# EAGLE design Fan__control_design (EAGLE 7.7.0)
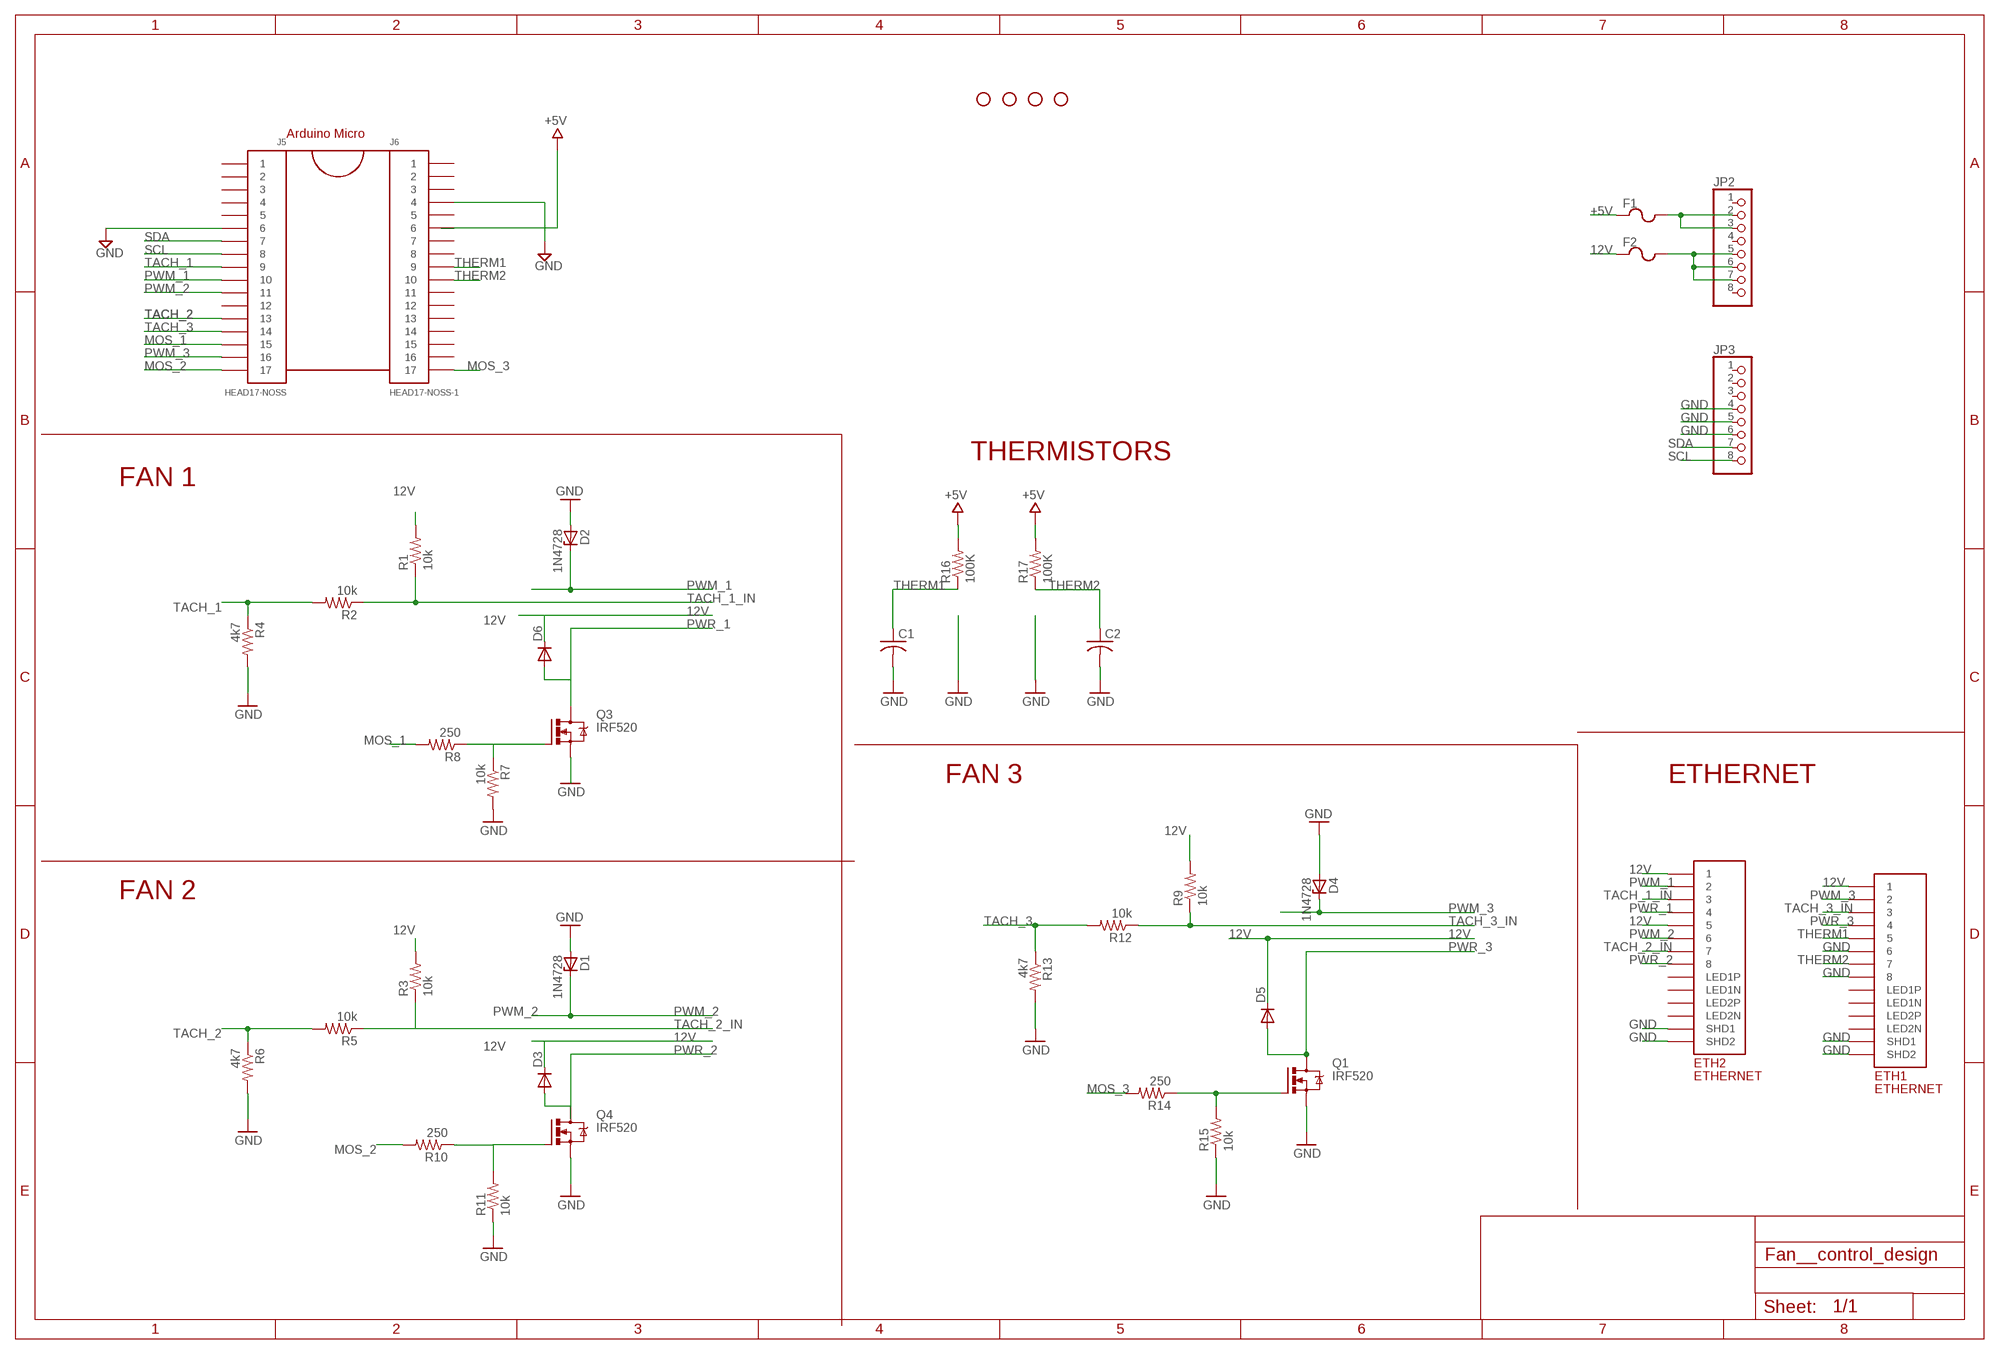
[diagram p0: schematic, sheet 1]

## Parts
C1  C-USC0603K  [C0603K]
C2  C-USC0603K  [C0603K]
D1  1N4728  [DO41Z10]
D2  1N4728  [DO41Z10]
D3  DIODE-DO214AC  [DO214AC]
D4  1N4728  [DO41Z10]
D5  DIODE-DO214AC  [DO214AC]
D6  DIODE-DO214AC  [DO214AC]
ETH1  ETHERNET  [A122645-ND]
ETH2  ETHERNET  [A122645-ND]
F1  POLYFUSE  [1206]
F2  POLYFUSE  [1206]
J5  HEAD17-NOSS  [HEAD17-NOSS]
J6  HEAD17-NOSS-1  [HEAD17-NOSS-1]
JP2  PINHD-1X8BIG  [1X08-BIG]
JP3  PINHD-1X8BIG  [1X08-BIG]
Q1  IRF520  [TO220BV]
Q3  IRF520  [TO220BV]
Q4  IRF520  [TO220BV]
R1  10k  R-US_R0603  [R0603]
R2  10k  R-US_R0603  [R0603]
R3  10k  R-US_R0603  [R0603]
R4  4k7  R-US_R0603  [R0603]
R5  10k  R-US_R0603  [R0603]
R6  4k7  R-US_R0603  [R0603]
R7  10k  R-US_R0603  [R0603]
R8  250  R-US_R0603  [R0603]
R9  10k  R-US_R0603  [R0603]
R10  250  R-US_R0603  [R0603]
R11  10k  R-US_R0603  [R0603]
R12  10k  R-US_R0603  [R0603]
R13  4k7  R-US_R0603  [R0603]
R14  250  R-US_R0603  [R0603]
R15  10k  R-US_R0603  [R0603]
R16  100K  R-US_R0603  [R0603]
R17  100K  R-US_R0603  [R0603]
STANDOFF1  STAND-OFF  [STAND-OFF]
STANDOFF2  STAND-OFF  [STAND-OFF]
STANDOFF3  STAND-OFF  [STAND-OFF]
STANDOFF4  STAND-OFF  [STAND-OFF]

## Nets
12V: D3.C D5.C D6.C ETH1.P$1 ETH2.P$1 ETH2.P$5 F2.1 R1.2 R3.2 R9.2
+5V: F1.1 J6.6 R16.2 R17.2
GND: C1.2 C2.2 D1.A D2.A D4.A ETH1.P$6 ETH1.P$8 ETH1.P$13(SHD1) ETH1.P$14(SHD2) ETH2.P$13(SHD1) ETH2.P$14(SHD2) J5.6 J6.4 JP3.4 JP3.5 JP3.6 Q1.S Q3.S Q4.S R4.2 R6.2 R7.2 R11.1 R13.2 R15.1
MOS_1: J5.15 R8.2
MOS_2: J5.17 R10.2
MOS_3: J6.17 R14.2
N$1: F1.2 JP2.2 JP2.3
N$2: F2.2 JP2.5 JP2.6 JP2.7
N$5: Q3.G R7.1 R8.1
N$8: Q4.G R10.1 R11.2
N$10: Q1.G R14.1 R15.2
PWM_1: D2.C ETH2.P$2 J5.10
PWM_2: D1.C ETH2.P$6 J5.11
PWM_3: D4.C ETH1.P$2 J5.16
PWR_1: D6.A ETH2.P$4 Q3.D
PWR_2: D3.A ETH2.P$8 Q4.D
PWR_3: D5.A ETH1.P$4 Q1.D
SCL: J5.8 JP3.8
SDA: J5.7 JP3.7
TACH_1: J5.9 R2.2 R4.1
TACH_1_IN: ETH2.P$3 R1.1 R2.1
TACH_2: J5.13 R5.2 R6.1
TACH_2_IN: ETH2.P$7 R3.1 R5.1
TACH_3: J5.14 R12.2 R13.1
TACH_3_IN: ETH1.P$3 R9.1 R12.1
THERM1: C1.1 ETH1.P$5 J6.9 R16.1
THERM2: C2.1 ETH1.P$7 J6.10 R17.1
Unconnected: ETH1.P$9(LED1N) ETH1.P$10(LED1P) ETH1.P$11(LED2N) ETH1.P$12(LED2P) ETH2.P$9(LED1N) ETH2.P$10(LED1P) ETH2.P$11(LED2N) ETH2.P$12(LED2P) J5.1 J5.2 J5.3 J5.4 J5.5 J5.12 J6.1 J6.2 J6.3 J6.5 J6.7 J6.8 J6.11 J6.12 J6.13 J6.14 J6.15 J6.16 JP2.1 JP2.4 JP2.8 JP3.1 JP3.2 JP3.3

## Notes on the sheet
- Arduino Micro
- THERMISTORS
- FAN 1
- FAN 3 | ETHERNET
- FAN 2

## Library data of the parts
C1 C2 = adafruit:C-US: CAPACITOR, American symbol
D1 D2 D4 = diode:1N4728: Z DIODE 3.3 V, 1W, 5 percent
D3 D5 D6 = diode:DIODE-: DIODE
ETH1 ETH2 = ETHERNET:ETHERNET: Ethernet port with 2 leds. digikey number A122645-ND
F1 F2 = polyfuse:POLYFUSE: Resistor Basic schematic elements and footprints for 0603, 1206, and PTH resistors.
J5 = SmartPrj:HEAD17-NOSS
J6 = SmartPrj:HEAD17-NOSS-1
JP2 JP3 = adafruit:PINHD-1X8: PIN HEADER
Q1 Q3 Q4 = transistor-power:IRF520: HEXFET Power MOSFET
R1-R17 = adafruit:R-US_: RESISTOR, American symbol
STANDOFF1-STANDOFF4 = SparkFun-Electromechanical:STAND-OFF: #4 Stand Off This is the mechanical footprint for a #4 phillips button head screw. Use the keepout ring to avoid running the screw head into surrounding components. SKU : PRT-00447

## Net classes
0 default: width 0.254 mm, drill 0.61 mm, clearance 0.203 mm

## Board
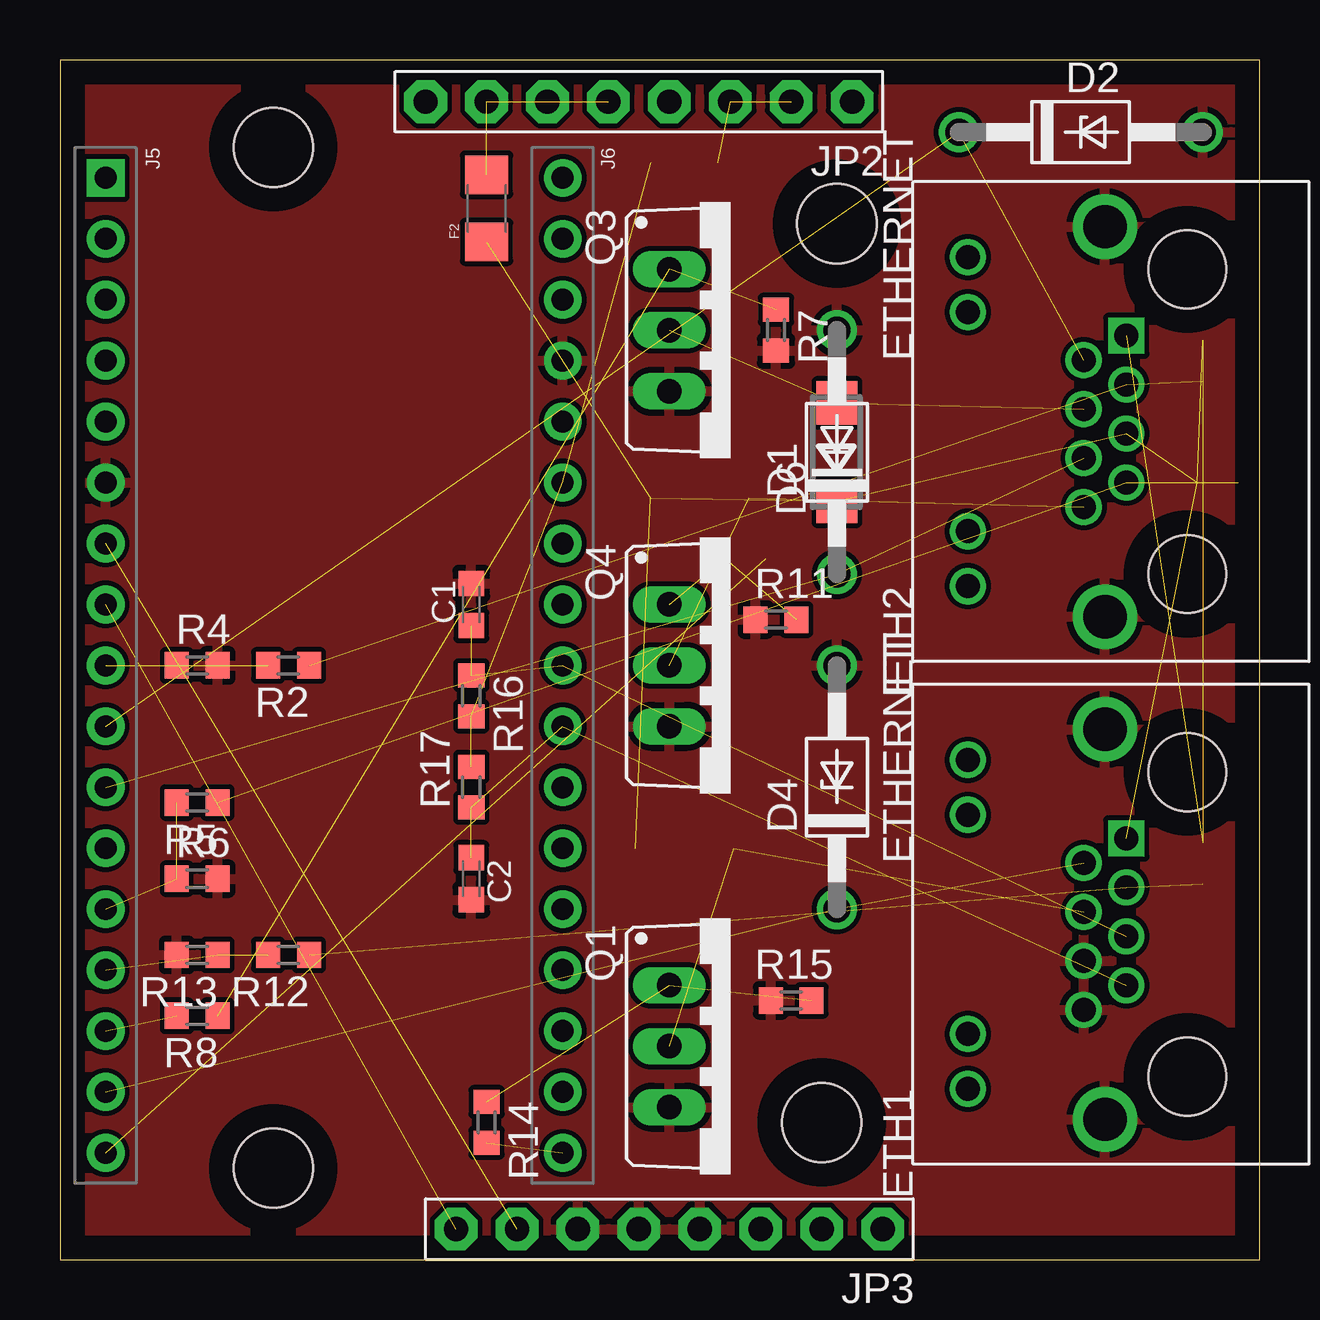
[diagram p1: board, top side]
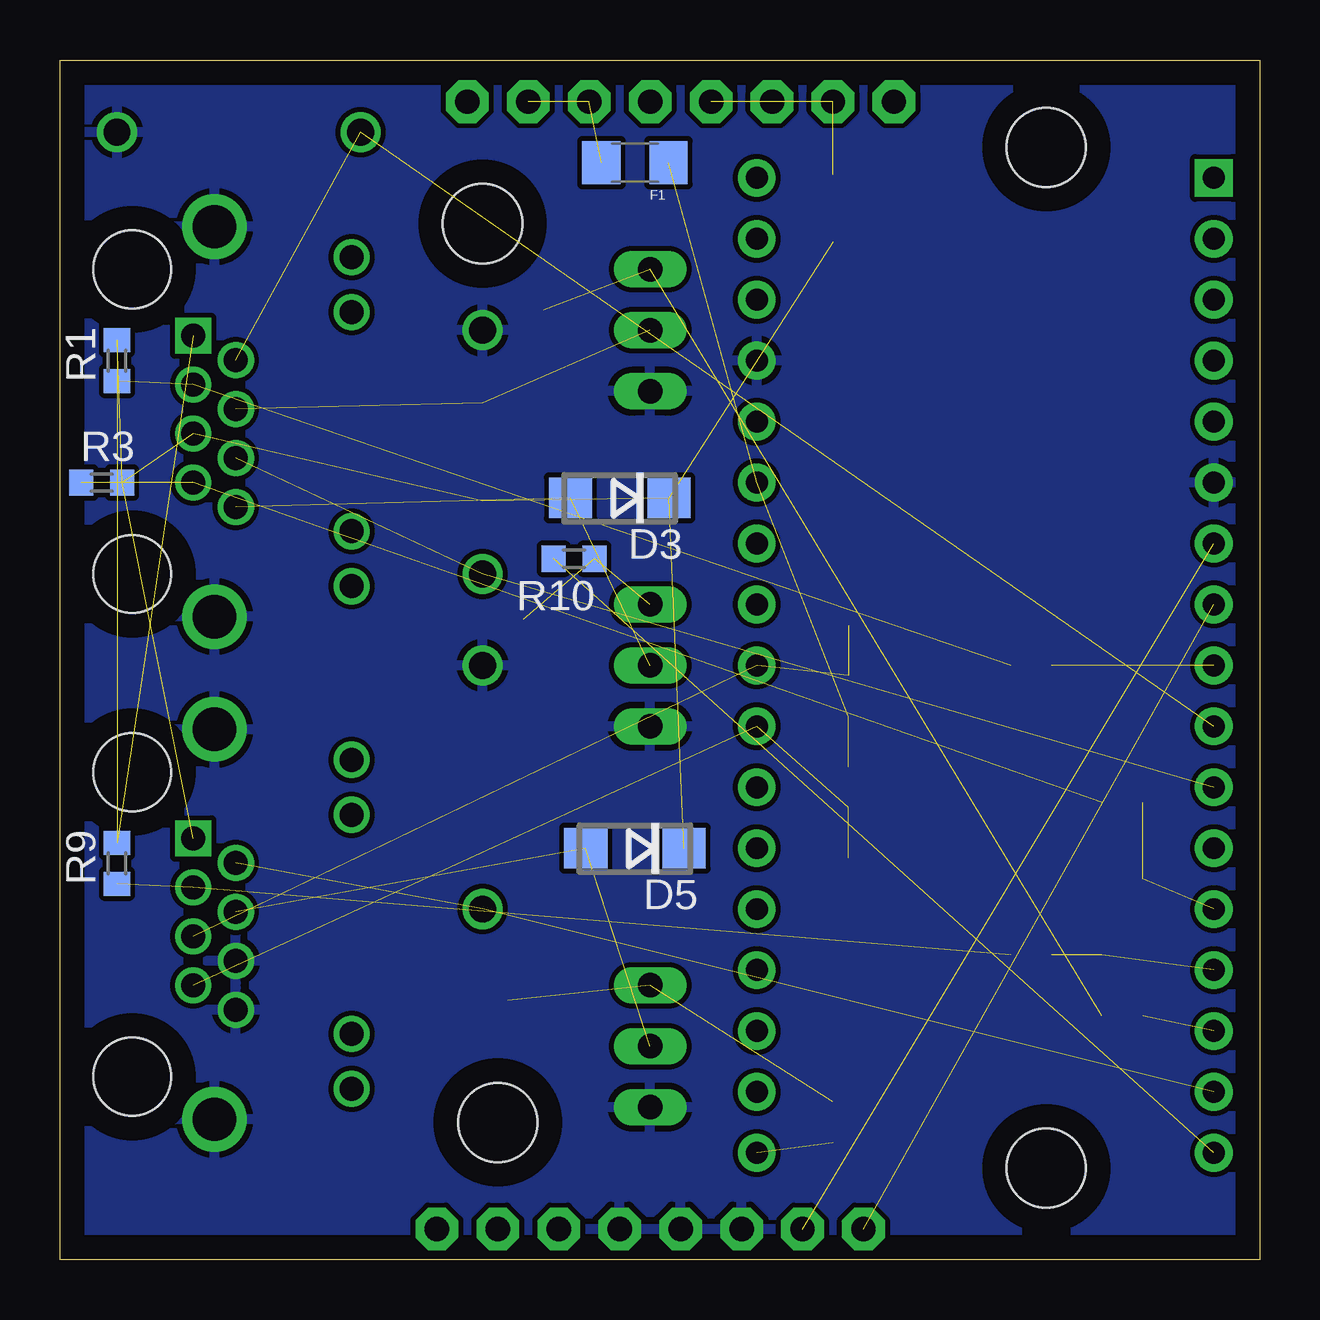
[diagram p2: board, bottom side, seen from below]

Size 50 x 50 mm. Coordinates in mm from the lower left corner, seen from the top.
Outline: 0,0 50,0 50,50 0,50 0,0
Copper layers (1*16): Top 0.035mm / dielectric 1.5mm / Bottom 0.035mm
Design rules "default": minimum track width 10mil, minimum drill 24mil, track to track 8mil, track to pad 8mil, pad to pad 8mil, via to via 8mil, smd to smd 8mil, copper to edge 40mil, drill to drill 8mil, minimum pad ring 10mil, minimum via ring 8mil, stop-mask expansion 4mil, vias tented up to drill 0mil, thermal gap 10mil

### Footprints (pad centres in the part's own frame; a part is rotated, then mirrored left to right if it is on the bottom)
C0603K = smd 1.05 x 1.08: 1 -0.875,0; 2 0.875,0
DO41Z10 = drill 1.118: A 5.08,0; C -5.08,0
DO214AC = smd 1.8 x 1.7: A 2.05,0; C -2.05,0
A122645-ND = drill 1 square: P$1 3.58,2.54 | drill 1: P$2 2.56,4.32; P$3 1.54,2.54; P$4 0.52,4.32; P$5 -0.5,2.54; P$6 -1.52,4.32; P$7 -2.54,2.54; P$8 -3.56,4.32; P$9 -6.86,9.14; P$10 -4.57,9.14; P$11 4.57,9.14; P$12 6.86,9.14 | drill 1.8: P$13 -8.13,3.43; P$14 8.13,3.43 | hole 3.25: -6.35,0; 6.35,0
1206 = smd 1.6 x 1.8: 1 -1.4,0; 2 1.4,0
HEAD17-NOSS = drill 0.914 pad 1.575 square: 1 0,0 | drill 0.914 pad 1.575: 2 2.54,0; 3 5.08,0; 4 7.62,0; 5 10.16,0; 6 12.7,0; 7 15.24,0; 8 17.78,0; 9 20.32,0; 10 22.86,0; 11 25.4,0; 12 27.94,0; 13 30.48,0; 14 33.02,0; 15 35.56,0; 16 38.1,0; 17 40.64,0
HEAD17-NOSS-1 = drill 0.914 pad 1.575: 1 0,0; 2 2.54,0; 3 5.08,0; 4 7.62,0; 5 10.16,0; 6 12.7,0; 7 15.24,0; 8 17.78,0; 9 20.32,0; 10 22.86,0; 11 25.4,0; 12 27.94,0; 13 30.48,0; 14 33.02,0; 15 35.56,0; 16 38.1,0; 17 40.64,0
1X08-BIG = drill 1.016 pad 1.778 octagon: 1 -8.89,0; 2 -6.35,0; 3 -3.81,0; 4 -1.27,0; 5 1.27,0; 6 3.81,0; 7 6.35,0; 8 8.89,0
TO220BV = drill 1.016 long: D 0,-2.54; G -2.54,-2.54; S 2.54,-2.54
R0603 = smd 1 x 1.1: 1 -0.85,0; 2 0.85,0
STAND-OFF = hole 3.302: 0,0

### Placement (x,y rotation side)
C1  17.14,27.3 90 top
C2  17.14,15.88 270 top
D1  32.38,33.66 90 top
D2  42.55,46.99 0 top
D3  26.67,31.75 180 bottom
D4  32.38,19.68 90 top
D5  26.04,17.14 180 bottom
D6  32.38,33.66 90 top
ETH1  46.99,13.97 90 top
ETH2  46.99,34.92 90 top
F1  26.04,45.72 180 bottom
F2  17.78,43.81 90 top
J5  1.91,45.09 270 top
J6  20.95,45.09 270 top
JP2  24.13,48.26 180 top
JP3  25.4,1.27 180 top
Q1  27.94,8.89 270 top
Q3  27.94,38.73 270 top
Q4  27.94,24.77 270 top
R1  47.62,37.47 90 bottom
R2  9.53,24.77 180 top
R3  48.26,32.38 0 bottom
R4  5.71,24.77 0 top
R5  5.71,19.05 180 top
R6  5.71,15.88 0 top
R7  29.84,38.73 270 top
R8  5.71,10.16 180 top
R9  47.62,16.51 90 bottom
R10  28.57,29.21 180 bottom
R11  29.84,26.67 0 top
R12  9.53,12.7 180 top
R13  5.71,12.7 180 top
R14  17.78,5.71 270 top
R15  30.48,10.79 0 top
R16  17.14,23.5 270 top
R17  17.14,19.68 90 top
STANDOFF1  8.89,3.81 0 top
STANDOFF2  8.89,46.35 0 top
STANDOFF3  31.75,5.71 0 top
STANDOFF4  32.38,43.18 0 top

### Tracks (layer width: path | path; a pad name or v marks a point on that pad's centre or on a via)
12V  (9 unrouted)
+5V  (3 unrouted)
GND
  pour Bottom: -3.17,53.98 55.88,53.98 55.88,12.06 55.88,-3.17 -3.17,-3.17
  pour Top: -3.17,53.98 56.52,53.98 56.52,-3.81 -3.17,-3.81
MOS_1  (1 unrouted)
MOS_2  (1 unrouted)
MOS_3  (1 unrouted)
N$1  (2 unrouted)
N$2  (3 unrouted)
N$5  (2 unrouted)
N$8  (2 unrouted)
N$10  (2 unrouted)
PWM_1  (2 unrouted)
PWM_2  (2 unrouted)
PWM_3  (2 unrouted)
PWR_1  (2 unrouted)
PWR_2  (2 unrouted)
PWR_3  (2 unrouted)
SCL  (1 unrouted)
SDA  (1 unrouted)
TACH_1  (2 unrouted)
TACH_1_IN  (2 unrouted)
TACH_2  (2 unrouted)
TACH_2_IN  (2 unrouted)
TACH_3  (2 unrouted)
TACH_3_IN  (2 unrouted)
THERM1  (3 unrouted)
THERM2  (3 unrouted)